# EAGLE design PCA9546 STEMMA QT (EAGLE 9.6.2)
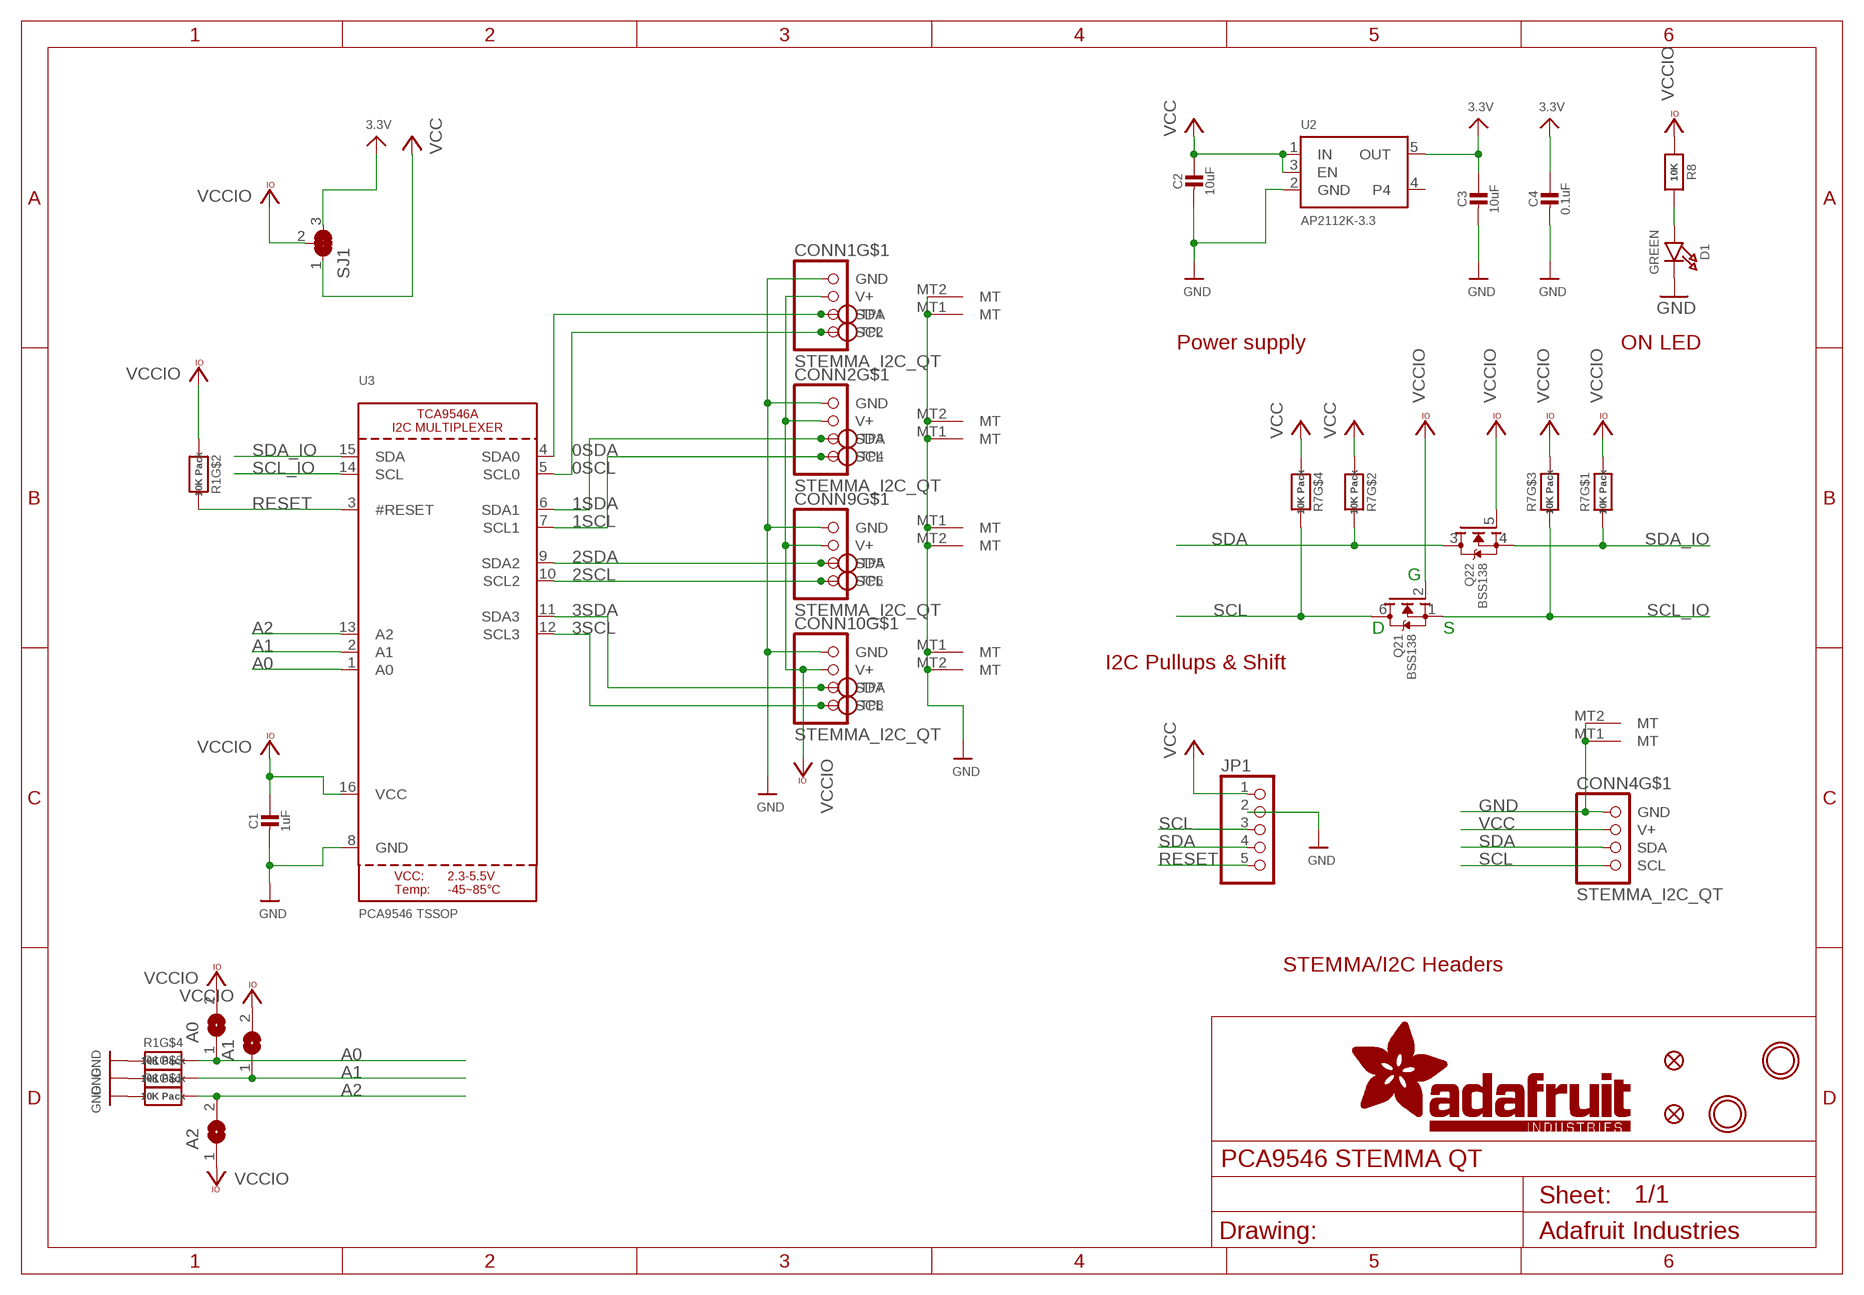
[diagram p0: schematic, sheet 1]

## Parts
A0  SOLDERJUMPER  [SOLDERJUMPER_ARROW_NOPASTE]
A1  SOLDERJUMPER  [SOLDERJUMPER_ARROW_NOPASTE]
A2  SOLDERJUMPER  [SOLDERJUMPER_ARROW_NOPASTE]
C1  1uF  CAP_CERAMIC0603_NO  [0603-NO]
C2  10uF  CAP_CERAMIC0805-NOOUTLINE  [0805-NO]
C3  10uF  CAP_CERAMIC0805-NOOUTLINE  [0805-NO]
C4  0.1uF  CAP_CERAMIC0603_NO  [0603-NO]
CONN1  STEMMA_I2C_QT  [JST_SH4]
CONN2  STEMMA_I2C_QT  [JST_SH4]
CONN4  STEMMA_I2C_QT  [JST_SH4]
CONN9  STEMMA_I2C_QT  [JST_SH4]
CONN10  STEMMA_I2C_QT  [JST_SH4]
D1  GREEN  LED0603_NOOUTLINE  [CHIPLED_0603_NOOUTLINE]
FID2  FIDUCIAL_1MM  [FIDUCIAL_1MM]
FID4  FIDUCIAL_1MM  [FIDUCIAL_1MM]
JP1  HEADER-1X570MIL  [1X05_ROUND_70]
Q2  BSS138  MOSFET-N_DUAL  [SOT363]
R1  10K Pack  RESISTOR_4PACK  [RESPACK_4X0603]
R7  10K Pack  RESISTOR_4PACK  [RESPACK_4X0603]
R8  10K  RESISTOR_0603_NOOUT  [0603-NO]
SJ1  SOLDERJUMPER_2WAY  [SOLDERJUMPER_2WAY_OPEN_NOPASTE]
TP1  TESTPOINTROUND1.5MMNO  [TESTPOINT_ROUND_1.5MM_NO]
TP2  TESTPOINTROUND1.5MMNO  [TESTPOINT_ROUND_1.5MM_NO]
TP3  TESTPOINTROUND1.5MMNO  [TESTPOINT_ROUND_1.5MM_NO]
TP4  TESTPOINTROUND1.5MMNO  [TESTPOINT_ROUND_1.5MM_NO]
TP5  TESTPOINTROUND1.5MMNO  [TESTPOINT_ROUND_1.5MM_NO]
TP6  TESTPOINTROUND1.5MMNO  [TESTPOINT_ROUND_1.5MM_NO]
TP7  TESTPOINTROUND1.5MMNO  [TESTPOINT_ROUND_1.5MM_NO]
TP8  TESTPOINTROUND1.5MMNO  [TESTPOINT_ROUND_1.5MM_NO]
U2  AP2112K-3.3  VREG_SOT23-5  [SOT23-5]
U3  PCA9546 TSSOP  XCA9546APW  [TSSOP16]
U$19  MOUNTINGHOLE2.5  [MOUNTINGHOLE_2.5_PLATED]
U$22  MOUNTINGHOLE2.5  [MOUNTINGHOLE_2.5_PLATED]

## Nets
0SCL: CONN1.4(SCL) TP2.P$1 U3.5(SCL0)
0SDA: CONN1.3(SDA) TP1.P$1 U3.4(SDA0)
1SCL: CONN2.4(SCL) TP4.P$1 U3.7(SCL1)
1SDA: CONN2.3(SDA) TP3.P$1 U3.6(SDA1)
2SCL: CONN9.4(SCL) TP6.P$1 U3.10(SCL2)
2SDA: CONN9.3(SDA) TP5.P$1 U3.9(SDA2)
3.3V [lowpower]: C3.1 C4.1 SJ1.3 U2.5(OUT)
3SCL: CONN10.4(SCL) TP8.P$1 U3.12(SCL3)
3SDA: CONN10.3(SDA) TP7.P$1 U3.11(SDA3)
A0: A0.1 R1.5 U3.1(A0)
A1: A1.1 R1.6 U3.2(A1)
A2: A2.2 R1.8 U3.13(A2)
GND: C1.2 C2.2 C3.2 C4.2 CONN1.1(GND) CONN1.MT1(MT) CONN1.MT2(MT) CONN2.1(GND) CONN2.MT1(MT) CONN2.MT2(MT) CONN4.1(GND) CONN4.MT1(MT) CONN4.MT2(MT) CONN9.1(GND) CONN9.MT1(MT) CONN9.MT2(MT) CONN10.1(GND) CONN10.MT1(MT) CONN10.MT2(MT) D1.C JP1.2 R1.1 R1.3 R1.4 U2.2(GND) U3.8(GND)
N$1: D1.A R8.2
RESET: JP1.5 R1.7 U3.3(#RESET)
SCL: CONN4.4(SCL) JP1.3 Q2.6(1:D) R7.5
SCL_IO: Q2.1(1:S) R7.6 U3.14(SCL)
SDA: CONN4.3(SDA) JP1.4 Q2.3(2:D) R7.7
SDA_IO: Q2.4(2:S) R7.8 U3.15(SDA)
VCC: C2.1 CONN4.2(V+) JP1.1 R7.2 R7.4 SJ1.1 U2.1(IN) U2.3(EN)
VCCIO: A0.2 A1.2 A2.1 C1.1 CONN1.2(V+) CONN2.2(V+) CONN9.2(V+) CONN10.2(V+) Q2.2(1:G) Q2.5(2:G) R1.2 R7.1 R7.3 R8.1 SJ1.2 U3.16(VCC)
Unconnected: U2.4

## Notes on the sheet
- Power supply | ON LED
- G
- D | S
- I2C Pullups & Shift
- STEMMA/I2C Headers

## Library data of the parts
A0 A1 A2 = microbuilder:SOLDERJUMPER: SMD Solder JUMPER Solder the two pads together to create a connection, or remove the solder to break it. REFLOW - Use this footprint for solder paste and reflow ovens. WAVE - Use this footprint for hand-soldering (larger pads). CLOSED - Has a trace between the two pads to ensure it is closed by default. The trace needs to be cut to disable the jumper, and can be closed again by creating a solder bridge between the two pads.; BOM: EXCLUDE
C1-C4 = microbuilder:CAP_CERAMIC: Ceramic Capacitors For new designs, use the packages preceded by an '_' character since they are more reliable: The following footprints should be used on most boards: _0402 - Standard footprint for regular board layouts _0603 - Standard footprint for regular board layouts _0805 - Standard footprint for regular board layouts _1206 - Standard footprint for regular board layouts For extremely tight-pitch boards where space is at a premium, the following 'micro-pitch' footprints can be used (smaller pads, no silkscreen outline, etc.): _0402MP - Micro-pitch footprint for very dense/compact boards _0603MP - Micro-pitch footprint for very dense/compact boards _0805MP - Micro-pitch footprint for very dense/compact boards _1206MP - Micro-pitch footprint for very dense/compact boards
CONN1 CONN2 CONN9 CONN10 = adafruit_electromech:STEMMA_I2C; LCSC: C2845363
CONN4 = microbuilder:STEMMA_I2C
D1 = microbuilder:LED: LED 0603 - 0603 Surface Mount Package 2mA: Green LED - Low Power (3.9mcd, 2ma, 1.7Vf) - Digikey: 475-2709-2-ND Orange LED - Low Power (9.8mcd, 2ma, 1.8Vf) - Digikey: 475-1194-2-ND Red LED - Low Power (5mcd, 2ma, 1.8Vf) - Digikey: 475-1195-2-ND Yellow LED - Low Power (7mcd, 2ma, 1.8Vf) - Digikey: 475-1196-2-ND 5mA: Blue LED - Low Power (17mcd, 5ma, 2.9Vf) - Digikey: LNJ937W8CRACT-ND 0805 - 0805 Surface Mount Package 2mA: Red LED (8.8mcd, 2mA, 1.8Vf, Clear) - Low Power [Digikey: 475-2510-1-ND] Green LED (5mcd, 2mA, 1.8Vf, Clear) - Low Power [Digikey: 475-2730-1-ND] Yellow LED (11.3mcd, 2mA, 1.8Vf, Clear) - Low Power [Digikey: 475-2555-1-ND] 20mA: Red LED (104mcd, 20mA, Diffused) - LS R976 [Digikey: 475-1278-6-ND] Red LED (12mcd, 20mA, 2.0Vf, Clear) - APT2012EC [Digikey: 754-1128-1-ND] Green LED (15mcd, 20mA, 2.2Vf, Clear) - APT2012GC [Digikey: 754-1131-1-ND] Orange LED (160mcd, 20mA, 2.1Vf, Clear) - APT2012SECK [Digikey: 754-1130-1-ND] 1206 - 1206 Surface Mount Package Green LED (26mcd, 20mA, Diffused) - LG N971 [Digikey: 475-1407-6-ND] Red LED (15mcd, 20mA, Diffused) - LH N974 [Digikey: 475-1416-6-ND] Cree - Cree High-Power Surface Mount LEDs XPEBWT-L1-0000-00D50 - White 111lm 350mA 2.9Vf 6200K 110° XTEAWT-00-0000-00000LEE3 - White 114lm 350mA 2.85Vf 5000K 115° Everlight - Everlight 45-21 Series Surface Mount LEDs 45-21/QK2C-B2832AC2CB2/2T - Warm White 2000mcd 20mA 3.25Vf 3050K 120° 45-21/LK2C-B38452C4CB2/2T - Nuetral White 2000mcd 20mA 3.25Vf 4150K 120° 45-21/LK2C-B50634C6CB2/2T - Cold White 2200mcd 20mA 3.25Vf 5650K 120° PLCC2 Reverse Mount LS T77K-J1L2-1-0-2-R18-Z - Red 11.25mcd 2mA 1.8Vf 630nm 120° LO T77K-L1M2-24-Z - Orange 19.6mcd 2mA 1.8Vf 606nm 120° LY T77K-K2M1-26-Z - Yellow 15.7mcd 2mA 1.8Vf 587nm 120°; ROT: 270
FID2 FID4 = microbuilder:FIDUCIAL: Fiducial Alignment Points Various fiducial points for machine vision alignment.; BOM: EXCLUDE
JP1 = microbuilder:HEADER-1X5: PIN HEADER
Q2 = microbuilder:MOSFET-N_DUAL: Dual N-Channel MOSFET SOT363 (2.0x1.25mm) 2N7002PS - 60V, 320mA [Digikey: 568-5984-1-ND]; JLC_ROTATION: 270
R1 R7 = microbuilder:RESISTOR_4PACK: Resistor Packs (4 resistors) 4 x 0603 10K 1/16W - Digikey: YC164J-10KCT-ND
R8 = microbuilder:RESISTOR: Resistors For new designs, use the packages preceded by an '_' character since they are more reliable: The following footprints should be used on most boards: _0402 - Standard footprint for regular board layouts _0603 - Standard footprint for regular board layouts _0805 - Standard footprint for regular board layouts _1206 - Standard footprint for regular board layouts For extremely tight-pitch boards where space is at a premium, the following 'micro-pitch' footprints can be used (smaller pads, no silkscreen outline, etc.): _0402MP - Micro-pitch footprint for very dense/compact boards _0603MP - Micro-pitch footprint for very dense/compact boards _0805MP - Micro-pitch footprint for very dense/compact boards _1206MP - Micro-pitch footprint for very dense/compact boards
SJ1 = microbuilder:SOLDERJUMPER_2WAY: 2-Way Solder Jumper
TP1-TP8 = microbuilder:TESTPOINT: Test Point Various test points for characterisation and PCB testing TESTPOINT_SMT - Compact Surface Mount Test Point [Digikey: 5016KTR-ND]
U2 = adafruit_power:VREG_SOT23-5: SOT23-5 Fixed Voltage Regulators Part Current Out V Out V In V Dropout θJA (°C/W) TJ (°C) Digikey Part No. ADP121 150mA 3.3V 3.4-5.5V 0.09V @ 150mA -- -- ADP121-AUJZ33R7CT-ND ADP121 150mA 3.0V 3.1-5.5V 0.09V @ 150mA -- -- ADP121-AUJZ30R7CT-ND ADP122 300mA 3.3V 3.4-5.5V 0.085V @ 300mA -- -- ADP122AUJZ-3.3-R7CT-ND ADP1712 300mA 3.3V 3.5-5.5V 0.17V @ 300mA -- -- ADP1712AUJZ-3.3-R7TR-ND AP7311 (Low Cost) 150mA 3.3V 3.5-6V 0.15V @ 150mA -- -- AP7311-33WG-7DICT-ND LD39015M18R 150mA 1.8V 1.9V-5.5V 0.08V @ 100mA -- -- 497-6977-1-ND LP2985A-33DBVR 150mA 3.3V 3.3-16V 0.28V @ 150mA 206 150 296-18479-1-ND MCP1824T-3302E/OT 300mA 3.3V 3.5V-6V 0.2V @ 300mA -- -- MCP1824T-3302E/OTCT-ND MIC5205-2.5YM5 TR 150mA 2.5V 2.7-16V 0.165V @ 150mA -- -- 576-1257-2-ND MIC5205-3.0YM5 TR 150mA 3.0V 3.2V-16V 0.165V @ 150mA -- -- 576-1258-2-ND MIC5205-3.3YM5 TR 150mA 3.3V 3.5V-16V 0.165V @ 150mA -- -- 576-1259-2-ND TPS780330220 150mA 3.3V+2.2V 3.6-5.5V 250mV Max -- -- 296-23332-1-ND TDA3663/N1,135 100mA 3.3V 3.5-45V 0.18V @ 50mA -- -- 568-5343-1-ND Max operating temp can be calculated using θJA, TJ (max junction temperature), and power in watts. Set the "Maximum Ambient Temperature" until it reaches TJ ("Max Junction Temperature"), which is the absolute limit for safe use of the regulator: Heat Sink Temperature Calculator <http://www.daycounter.com/Calculators/Heat-Sink-Temperature-Calculator.phtml> For example, With 12V source into a 3.3V LP2985 and a 30mA load, we are dissipating (12V-3.3V) * 0.03A = 0.261W. With a θJA of 206 °C/W, a TJ of 150°C, and 261mW we can safely use the chip without a heat sink up to 75°C (=147.1°C Junction Temperature).; JLC_ROTATION: 0
U3 = microbuilder:XCA9546A: TCA9548A I2C Multiplexer
U$19 U$22 = adafruit_electromech:MOUNTINGHOLE: Mounting Hole For #2 screws (0.086"/2.18mm width, 0.094"/2.4mm hole) use 2.5mm; BOM: EXCLUDE

## Net classes
1 highpower: width 0.305 mm, drill 0.483 mm
2 lowpower: width 0.254 mm, drill 0.483 mm

## Board
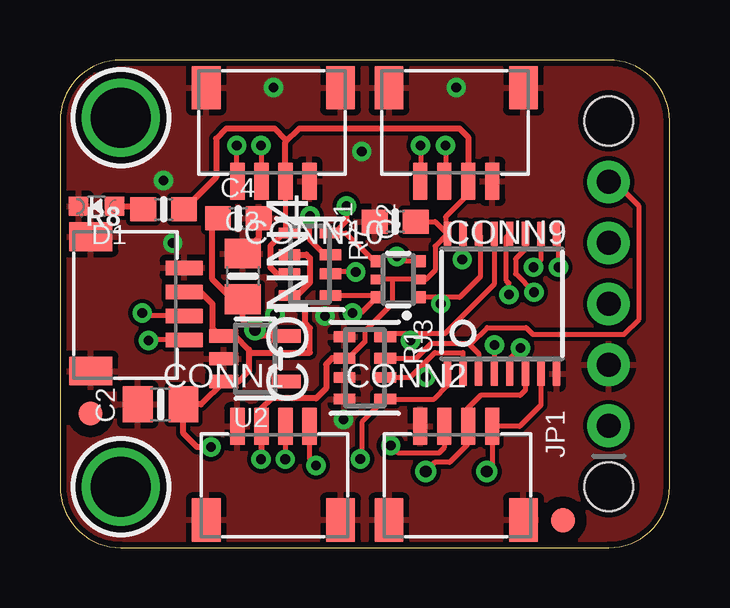
[diagram p1: board, top side]
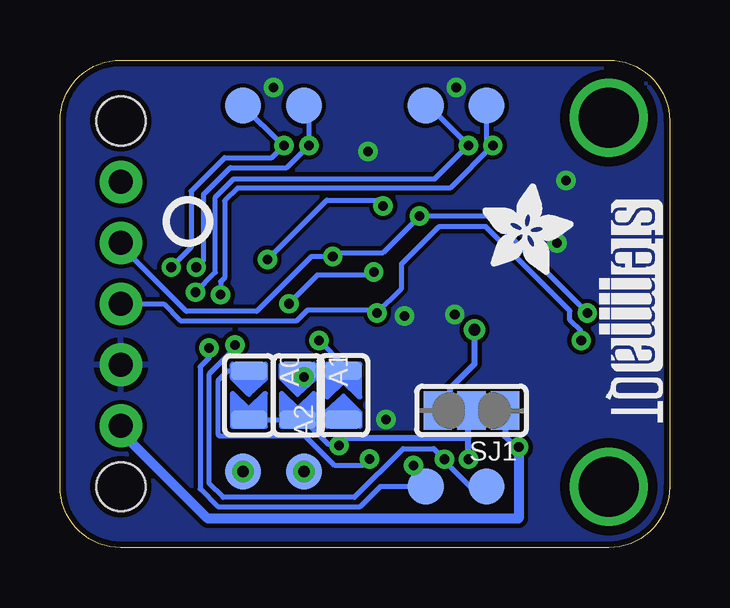
[diagram p2: board, bottom side, seen from below]

Size 25.4 x 20.32 mm. Coordinates in mm from the lower left corner, seen from the top.
Outline: 0,17.78 0,2.54 arc90 2.54,0 22.86,0 arc90 25.4,2.54 25.4,17.78 arc90 22.86,20.32 2.54,20.32 arc90 0,17.78
Copper layers (1*16): Top 0.035mm / dielectric 1.5mm / Bottom 0.035mm
Design rules "adafruit 7-7": minimum track width 7mil, minimum drill 15.5mil, track to track 7mil, track to pad 7mil, pad to pad 7mil, via to via 7mil, smd to smd 7mil, copper to edge 10mil, drill to drill 8mil, minimum pad ring 7mil, minimum via ring 8mil, stop-mask expansion 2mil, vias tented up to drill 20mil, thermal gap 10mil
Holes 2.03 mm at 22.86,17.78 22.86,2.54

### Footprints (pad centres in the part's own frame; a part is rotated, then mirrored left to right if it is on the bottom)
SOLDERJUMPER_ARROW_NOPASTE = smd 0.762 x 1.524: 1 -1.016,0; 2 1.016,0
0603-NO = smd 1.075 x 1: 1 -0.85,0; 2 0.85,0
0805-NO = smd 1.24 x 1.5: 1 -0.95,0; 2 0.95,0
JST_SH4 = smd 0.6 x 1.55: 1 -1.5,2.006; 2 -0.5,2.006; 3 0.5,2.006; 4 1.5,2.006 | smd 1.2 x 1.8: MT1 -2.8,-1.894; MT2 2.8,-1.894
JST_SH4' = smd 0.6 x 1.55: 1 -1.5,2.514; 2 -0.5,2.514; 3 0.5,2.514; 4 1.5,2.514 | smd 1.2 x 1.8: MT1 -2.8,-1.386; MT2 2.8,-1.386
CHIPLED_0603_NOOUTLINE = smd 0.8 x 0.8: A 0,-0.75; C 0,0.75
FIDUCIAL_1MM = smd 1 x 1: 1 0,0
1X05_ROUND_70 = drill 1 pad 1.778: 1 -5.08,0; 2 -2.54,0; 3 0,0; 4 2.54,0; 5 5.08,0
SOT363 = smd 0.5 x 0.5: 1 -0.75,-0.9; 3 0.75,-0.9; 4 0.75,0.9; 6 -0.75,0.9 | smd 0.4 x 0.5: 2 0,-0.9; 5 0,0.9
RESPACK_4X0603 = smd 0.45 x 0.9: 1 -1.3,-0.85; 2 -0.4,-0.85; 3 0.4,-0.85; 4 1.3,-0.85; 5 1.3,0.85; 6 0.4,0.85; 7 -0.4,0.85; 8 -1.3,0.85
SOLDERJUMPER_2WAY_OPEN_NOPASTE = smd 1.168 x 1.6: 1 -1.397,0; 2 0,0; 3 1.397,0
TESTPOINT_ROUND_1.5MM_NO = smd 1.5 x 1.5: P$1 0,0
SOT23-5 = smd 0.55 x 1.2: 1 -0.95,-1.3; 2 0,-1.3; 3 0.95,-1.3; 4 0.95,1.3; 5 -0.95,1.3
TSSOP16 = smd 0.305 x 0.991: 1 -2.275,-2.918; 2 -1.625,-2.918; 3 -0.975,-2.918; 4 -0.325,-2.918; 5 0.325,-2.918; 6 0.975,-2.918; 7 1.625,-2.918; 8 2.275,-2.918; 9 2.275,2.918; 10 1.625,2.918; 11 0.975,2.918; 12 0.325,2.918; 13 -0.325,2.918; 14 -0.975,2.918; 15 -1.625,2.918; 16 -2.275,2.918
MOUNTINGHOLE_2.5_PLATED = drill 2.5 pad 3.2: P$1 0,0

### Placement (x,y rotation side)
A0  17.53,6.35 270 bottom
A1  15.49,6.35 270 bottom
A2  13.59,6.35 90 bottom
C1  13.97,13.59 180 top
C2  4.19,5.97 180 top
C3  7.62,11.3 90 top
C4  7.43,13.72 0 top
CONN1  8.89,3.05 0 top
CONN2  16.51,3.05 0 top
CONN4  STEMMA_I2C_QT  [JST_SH4']  2.67,10.16 270 top
CONN9  16.51,17.27 180 top
CONN10  8.89,17.27 180 top
D1  1.52,14.22 90 top
FID2  1.27,5.59 0 top
FID4  20.95,1.14 0 top
JP1  22.86,10.16 90 top
PLABEL0  [PLABEL0]  24.51,5.08 90 top
PLABEL1  [PLABEL1]  24.64,7.62 90 top
PLABEL2  [PLABEL2]  24.51,9.91 90 top
PLABEL3  [PLABEL3]  24.51,12.7 90 top
PLABEL4  [PLABEL4]  24.51,15.75 90 top
PLABEL5  [PLABEL5]  0.38,14.99 0 top
PLABEL6  [PLABEL6]  4.95,16.26 0 top
PLABEL7  [PLABEL7]  20.45,16.13 0 top
PLABEL8  [PLABEL8]  5.08,4.13 0 top
PLABEL9  [PLABEL9]  20.51,4.13 0 top
PLABEL10  [PLABEL10]  17.08,8.19 90 bottom
PLABEL11  [PLABEL11]  15.11,8.26 90 bottom
PLABEL12  [PLABEL12]  12.95,8.19 90 bottom
PLABEL13  [PLABEL13]  12.76,15.49 0 bottom
PLABEL14  [PLABEL14]  12.57,12.06 0 bottom
PLABEL15  [PLABEL15]  12.83,1.02 0 bottom
PLABEL16  [PLABEL16]  8.13,7.49 0 bottom
PLABEL17  [PLABEL17]  5.21,5.97 90 bottom
PLABEL18  [PLABEL18]  11.3,5.71 90 bottom
Q2  14.1,11.18 90 top
R1  12.7,7.49 270 top
R7  10.41,11.81 270 top
R8  4.32,14.1 180 top
SJ1  8.26,5.71 180 bottom
TP1  7.62,2.54 90 bottom
TP2  10.16,2.54 90 bottom
TP3  15.24,3.17 90 bottom
TP4  17.78,3.17 90 bottom
TP5  17.78,18.41 90 bottom
TP6  15.24,18.41 90 bottom
TP7  10.16,18.41 90 bottom
TP8  7.62,18.41 90 bottom
U2  8.13,7.87 270 top
U3  18.41,10.16 0 top
U$19  2.54,17.91 0 top
U$22  2.54,2.54 0 top
U$28  [ADAFRUIT_3.5MM]  7.81,11.37 0 bottom
U$29  [PCBFEAT-REV-040]  20.07,13.59 0 bottom
U$31  [STEMMAQT]  2.92,14.48 270 bottom

### Tracks (layer width: path | path; a pad name or v marks a point on that pad's centre or on a via)
0SCL  (via drill 0.4)
  Top 0.203: U3.5 18.74,7.88 v19.18,8.33 | CONN1.4 10.39,3.71 v10.67,3.43
  Bottom 0.203: v19.18,8.33 19.18,7.91 19.56,7.53 19.56,2.45 18.83,1.71 12.89,1.71 12.06,2.54 TP2.P$1 10.16,2.92 v10.67,3.43
0SDA  (via drill 0.4)
  Top 0.203: CONN1.3 v9.39,3.68 v9.38,3.68 | v18.1,8.45 18.1,7.25 U3.4
  Bottom 0.203: v18.1,8.45 18.1,8.32 19.18,7.25 19.18,2.67 18.61,2.1 13.13,2.1 11.1,4.13 9.83,4.13 v9.38,3.68 9.38,3.62 7.77,2 TP1.P$1
1SCL  (via drill 0.48)
  Top 0.203: U3.7 20.04,5.94 19.15,5.05 CONN2.4 18.01,3.17 TP4.P$1
  other vias: 17.78,3.17
1SDA  (via drill 0.48)
  Top 0.203: U3.6 19.39,6.56 19.18,6.35 17.53,6.35 17.01,5.83 CONN2.3 16.97,5.02 16.97,4.29 16.24,3.56 15.62,3.56 TP3.P$1
  other vias: 15.24,3.17
2SCL  (via drill 0.4)
  Top 0.203: U3.10 20.04,12 v19.72,11.68 | v15.02,16.76 15.02,14.77 CONN9.4
  Bottom 0.203: v19.72,11.68 19.43,11.98 19.43,14.7 18.3,15.83 15.96,15.83 v15.02,16.76 15.02,18.2 TP6.P$1
2SDA  (via drill 0.4)
  Top 0.203: U3.9 20.77,13 v20.77,11.68 | v16.07,16.76 16.07,14.81 CONN9.3
  Bottom 0.203: v20.77,11.68 19.94,12.51 19.94,14.86 18.54,16.26 16.57,16.26 v16.07,16.76 16.13,16.76 TP5.P$1
3.3V  (via drill 0.48)
  Top 0.254: U2.5 8.38,8.82 | 8.38,8.82 8.26,8.82 7.62,9.46 C3.1 7.17,10.35 6.35,11.18 6.35,13.49 C4.1 | v8.13,9.08 8.38,8.82
  Bottom 0.254: SJ1.3 9.14,6.22 9.14,6.64 8.13,7.66 v8.13,9.08
3SCL  (via drill 0.4)
  Top 0.203: CONN10.4 7.37,14.78 v7.37,16.76 | v18.71,10.54 18.71,11.02 18.6,11.13 18.6,12.94 U3.12
  Bottom 0.203: v18.71,10.54 18.71,11.08 18.54,11.25 18.54,14.45 18,14.99 9.14,14.99 v7.37,16.76 7.62,17.02 TP8.P$1
3SDA  (via drill 0.4)
  Top 0.203: U3.11 19.39,12.44 18.98,12.03 18.98,11.41 v19.75,10.64 | v8.38,16.76 v8.39,16.76 CONN10.3
  Bottom 0.203: v19.75,10.64 18.92,11.47 18.92,14.61 18.16,15.37 9.78,15.37 v8.38,16.76 10.03,18.41 TP7.P$1
A0  (via drill 0.4)
  Top 0.203: U3.1 16.14,6.74 15.59,6.19 R1.5 12.57,5.22 12.57,3.76 v12.51,3.7
  Bottom 0.203: v12.51,3.7 12.77,3.44 13.97,3.44 15.18,4.65 17.84,4.65 18.75,4.65 18.8,4.7 18.8,6.99 18.41,7.37 A0.1
A1  (via drill 0.4)
  Top 0.203: R1.6 14.59,7.09 15.24,7.75 | U3.2 16.79,8.13 15.62,8.13 15.24,7.75 | 15.24,7.75 v15.24,7.11
  Bottom 0.203: A1.1 v15.24,7.11
A2  (via drill 0.4)
  Top 0.203: U3.13 18.09,10.98 16.03,8.92 14.61,8.92 | 14.61,8.92 13.68,8.92 R1.8 | v14.61,8.64 14.61,8.92
  Bottom 0.203: A2.2 13.59,7.62 v14.61,8.64
GND  (via drill 0.4)
  Top 0.254: C4.2 8.28,12.91 C3.2
  other vias: 4.7,12.7 11.05,9.65 4.32,15.3 8.89,19.18 12.57,16.51 16.51,19.18 11.81,5.33 8.95,9.72
  pour Top: 0,0 0,20.32 25.4,20.32 25.4,0
  pour Bottom: 0,0 0,20.32 25.4,20.32 25.4,0
N$1
  Top 0.254: D1.A 3.34,14.22 R8.2
N$2
  Bottom 0.203: 7.37,5.71 7.75,5.71
RESET
  Top 0.203: R1.7 14.85,7.89 15.46,8.51 17.02,8.51 | U3.3 17.44,8.09 17.02,8.51 | 17.02,8.51 17.14,8.51 17.8,9.17 19.43,9.17 19.71,8.89 23.5,8.89 24.13,9.53 24.13,14.22 23.11,15.24 JP1.5
SCL  (via drill 0.4)
  Top 0.203: R7.5 13.11,10.51 Q2.6 12.55,9.78 v12.19,9.78 | CONN4.4 3.71,8.66 v3.68,8.64
  Bottom 0.203: JP1.3 21.08,10.16 20.38,9.46 15.53,9.46 15.08,9.91 12.32,9.91 v12.19,9.78 11.18,10.79 11.18,11.81 9.62,13.37 7.66,13.37 4.15,9.87 4.15,9.48 3.68,9.01 v3.68,8.64
SCL_IO  (via drill 0.4)
  Top 0.203: U3.14 17.5,13.01 17.5,11.28 16.65,10.43 16.13,10.43 | 16.13,10.43 Q2.1 | v12.32,11.49 11.35,11.49 R7.6 | 16.13,10.43 v15.87,10.16
  Bottom 0.203: v12.32,11.49 12.45,11.37 14.66,11.37 v15.87,10.16
SDA  (via drill 0.4)
  Top 0.203: Q2.3 14.24,11.93 v14.03,12.13 | R7.7 11.03,12.21 10.41,12.83 v10.41,13.82 | CONN4.3 3.55,9.66 v3.43,9.78
  Bottom 0.203: JP1.4 22.86,12.57 20.13,9.84 17.21,9.84 14.92,12.13 v14.03,12.13 13.87,12.29 11.94,12.29 v10.41,13.82 7.47,13.82 v3.43,9.78
SDA_IO  (via drill 0.4)
  Top 0.203: R7.8 11.43,13.11 | 11.43,13.11 11.91,13.11 13.09,11.93 Q2.4 | U3.15 16.79,12.03 v16.76,12 | v11.94,14.24 11.94,13.62 11.43,13.11
  Bottom 0.203: v16.76,12 14.28,14.48 12.17,14.48 v11.94,14.24
VCC  (via drill 0.4)
  Top 0.254: CONN4.2 5.85,10.66 6.35,10.16 6.35,9.14 6.67,8.82 U2.1 7.3,8.82 7.87,8.26 7.87,8.13 | 7.87,8.13 7.87,7.37 7.43,6.92 U2.3 5.87,5.97 C2.1 5.14,4.76 5.71,4.19 v6.29,4.19 | 7.87,8.13 10.41,8.13 10.41,9.15 10.2,9.37 10.2,9.88 R7.4 9.88,10.51 10.41,11.05 10.41,12.06 10.27,12.21 R7.2
  Bottom 0.254: SJ1.1 6.86,4.64 6.41,4.19 v6.29,4.19
  Bottom 0.406: v6.29,4.19 6.29,1.21 19.24,1.21 22.86,4.83 JP1.1
VCCIO  (via drill 0.4)
  Top 0.203: 13.84,11.18 Q2.2 15.25,11.18 15.63,11.55 15.63,12.57 U3.16 16.07,13.15 | 13.84,11.18 Q2.5 | C1.1 15.63,13.59 16.07,13.15 | CONN9.2 17.01,14.72 16.07,13.78 16.07,13.15 | CONN2.2 16.01,4.17 15.78,3.94 14.1,3.94 v13.78,4.25 | CONN10.2 9.39,13.29 R7.1 | 13.84,11.18 13.84,10.16 12.7,9.02 12.7,8.57 12.02,7.89 R1.2
  Top 0.254: R1.2 11.34,7.89 11.09,7.64 11.09,6.64 10.67,6.22 8.81,6.22 8.39,5.8 CONN1.2 v8.38,3.68 | R7.1 9.3,13.11 8.76,12.57 8.76,11.68 9.04,11.41 R7.3 | CONN10.2 9.39,16.88 | CONN9.2 17.01,17.1 16.64,17.48 9.98,17.48 9.39,16.88 | R8.1 6.5,15.43 6.5,17.04 6.93,17.47 8.94,17.47 9.39,17.03 9.39,16.88
  Bottom 0.203: A0.2 A1.2 | A1.2 A2.1 | A1.2 15.24,5.33 14.22,4.32 13.84,4.32
  Bottom 0.254: v8.38,3.68 8.38,4.57 | 8.38,4.57 13.59,4.57 13.78,4.38 | 13.84,4.32 13.78,4.38 | 13.78,4.38 v13.78,4.25 | 8.38,4.57 8.38,5.59 SJ1.2

### Text on the board
Pinguin_tBackup: 3 | 2 | RST | on | SDA | SCL | - | V+ | 0 | 1
Pinguin_bBackup: PCA9546A | 4-Channel / I2C Multiplexer | A1 | A0 | A2 | Vout | V+ | 3V | VLogic/Vcc: 3-5VDC